# EAGLE design Shield STM32F407VET6 Mini (EAGLE 9.3.1)
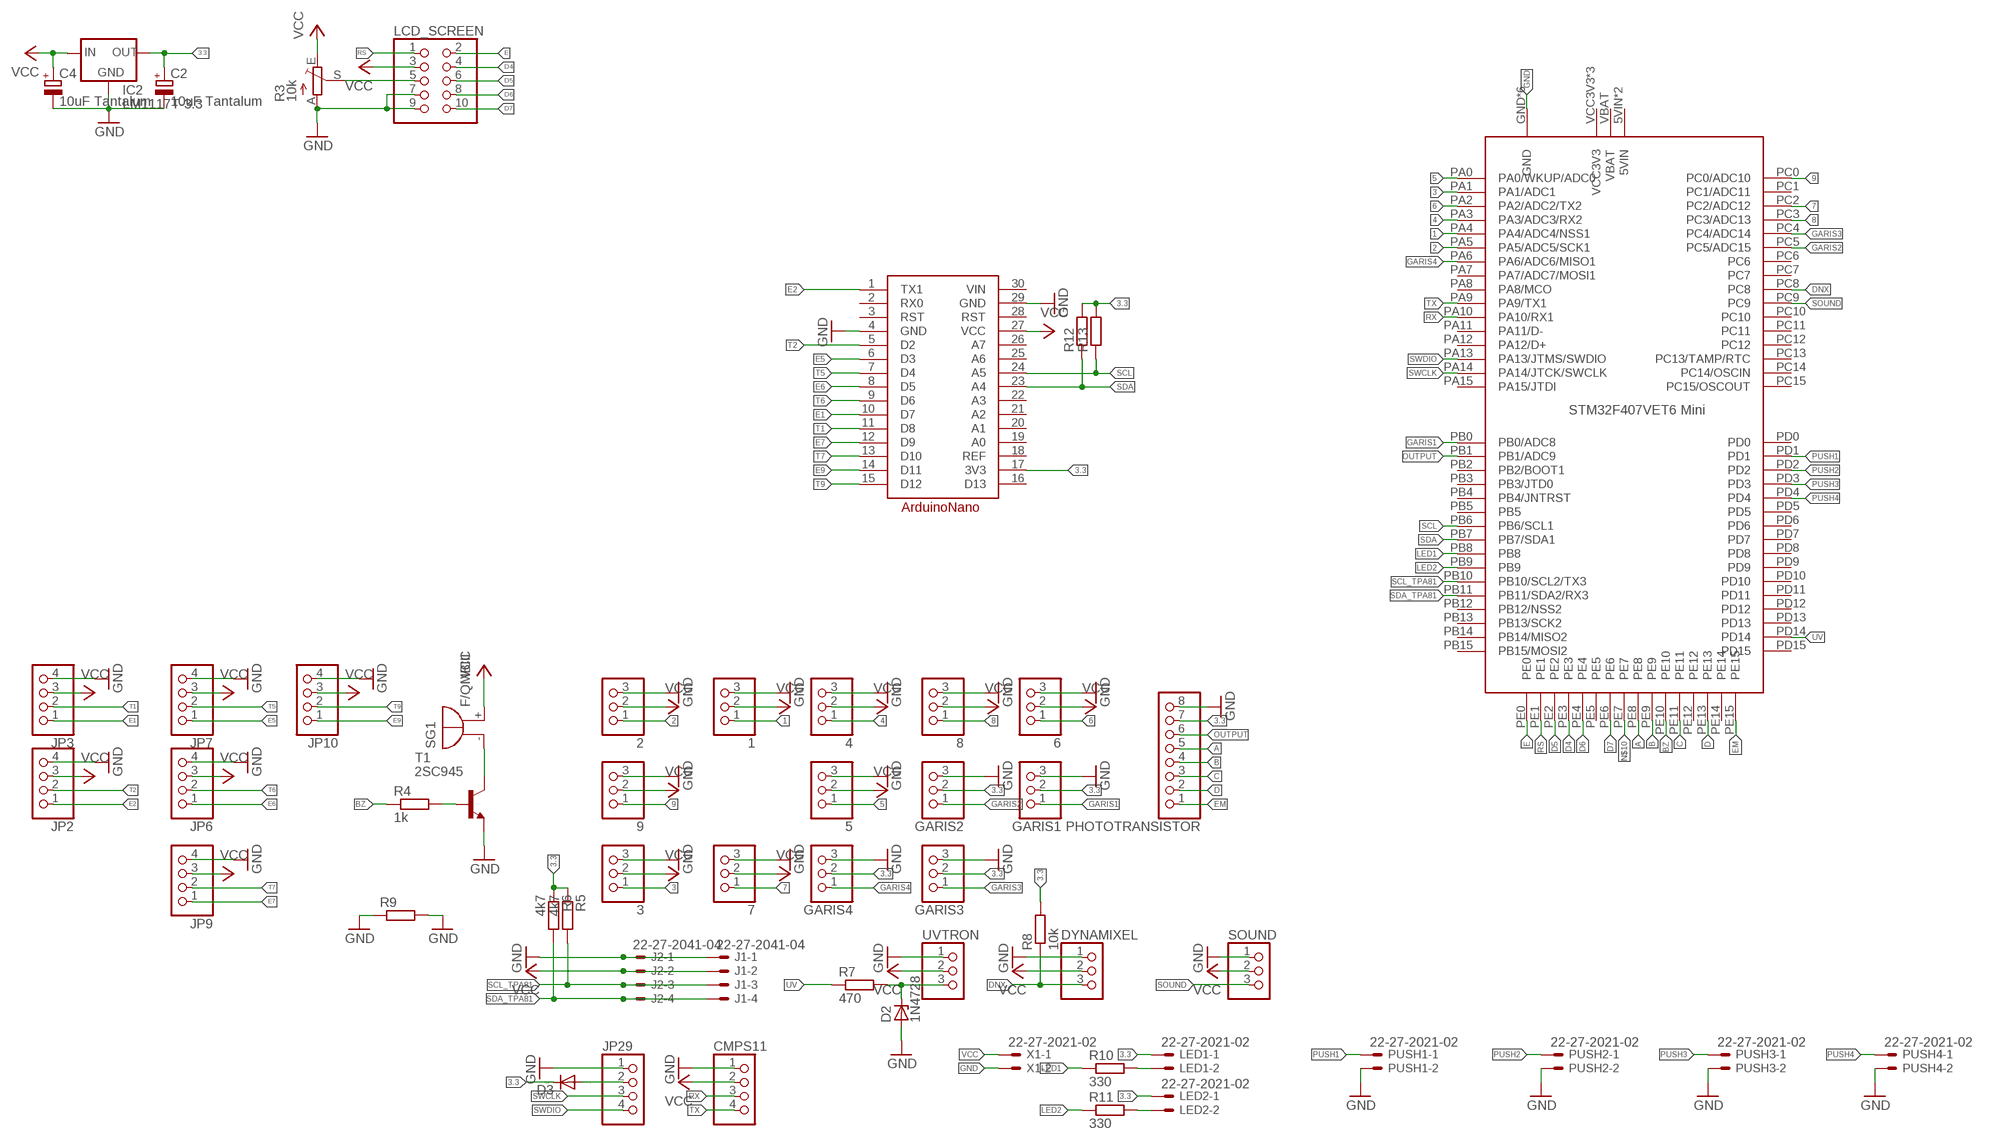
[diagram p0: schematic, sheet 1]

## Parts
1  PINHD-1X3  [1X03]
2  PINHD-1X3  [1X03]
3  PINHD-1X3  [1X03]
4  PINHD-1X3  [1X03]
5  PINHD-1X3  [1X03]
6  PINHD-1X3  [1X03]
7  PINHD-1X3  [1X03]
8  PINHD-1X3  [1X03]
9  PINHD-1X3  [1X03]
A1  ARDUINONANO  [ARDUINONANO]
C2  10uF Tantalum  CPOL-EUE2.5-5  [E2,5-5]
C4  10uF Tantalum  CPOL-EUE2.5-5  [E2,5-5]
CMPS11  PINHD-1X4  [1X04]
D2  1N4728  ZENER-DIODEZD-7.5  [ZDIO-7.5]
D3  DIODE-DO34-7  [DO34-7]
DYNAMIXEL  PINHD-1X3  [1X03]
GARIS1  PINHD-1X3  [1X03]
GARIS2  PINHD-1X3  [1X03]
GARIS3  PINHD-1X3  [1X03]
GARIS4  PINHD-1X3  [1X03]
IC2  LM1117T-3.3  [TO220]
J1  22-27-2041-04  [6410-04]
J2  22-27-2041-04  [6410-04]
JP2  PINHD-1X4  [1X04]
JP3  PINHD-1X4  [1X04]
JP6  PINHD-1X4  [1X04]
JP7  PINHD-1X4  [1X04]
JP9  PINHD-1X4  [1X04]
JP10  PINHD-1X4  [1X04]
JP29  PINHD-1X4  [1X04]
LCD_SCREEN  PINHD-2X5  [2X05]
LED1  22-27-2021-02  [6410-02]
LED2  22-27-2021-02  [6410-02]
PHOTOTRANSISTOR  PINHD-1X8  [1X08]
PUSH1  22-27-2021-02  [6410-02]
PUSH2  22-27-2021-02  [6410-02]
PUSH3  22-27-2021-02  [6410-02]
PUSH4  22-27-2021-02  [6410-02]
R3  10k  TRIM_EU-CA6V  [CA6V]
R4  1k  R-EU_0204/7  [0204/7]
R5  4k7  R-EU_0204/7  [0204/7]
R6  4k7  R-EU_0204/7  [0204/7]
R7  470  R-EU_0204/7  [0204/7]
R8  10k  R-EU_0204/7  [0204/7]
R9  R-EU_0204/5  [0204/5]
R10  330  R-EU_M1206  [M1206]
R11  330  R-EU_M1206  [M1206]
R12  R-EU_0204/7  [0204/7]
R13  R-EU_0204/7  [0204/7]
SG1  F/QMBIII  [F/QMBIII]
SOUND  PINHD-1X3  [1X03]
T1  2SC945  [TO92-ECB]
U$2  STM32F407VET6_MINI  [STM32F407VET6_MINI]
UVTRON  PINHD-1X3  [1X03]
X1  22-27-2021-02  [6410-02]

## Nets
1: 1.1 U$2.PA4(PA4/ADC4/NSS1)
2: 2.1 U$2.PA5(PA5/ADC5/SCK1)
3: 3.1 U$2.PA1(PA1/ADC1)
3.3: A1.17(3V3) C2.+ D3.C GARIS1.2 GARIS2.2 GARIS3.2 GARIS4.2 IC2.2(OUT) LED1.1 LED2.1 PHOTOTRANSISTOR.7 R5.1 R6.1 R8.2 R12.2 R13.2
4: 4.1 U$2.PA3(PA3/ADC3/RX2)
5: 5.1 U$2.PA0(PA0/WKUP/ADC0)
6: 6.1 U$2.PA2(PA2/ADC2/TX2)
7: 7.1 U$2.PC2(PC2/ADC12)
8: 8.1 U$2.PC3(PC3/ADC13)
9: 9.1 U$2.PC0(PC0/ADC10)
A: PHOTOTRANSISTOR.5 U$2.PE8
B: PHOTOTRANSISTOR.4 U$2.PE9
BZ: R4.1 U$2.PE10
C: PHOTOTRANSISTOR.3 U$2.PE11
D: PHOTOTRANSISTOR.2 U$2.PE13
D4: LCD_SCREEN.4 U$2.PE3
D5: LCD_SCREEN.6 U$2.PE2
D6: LCD_SCREEN.8 U$2.PE4
D7: LCD_SCREEN.10 U$2.PE6
DNX: DYNAMIXEL.3 R8.1 U$2.PC8
E: LCD_SCREEN.2 U$2.PE0
E1: A1.10(D7) JP3.1
E2: A1.1(TX1) JP2.1
E5: A1.6(D3) JP7.1
E6: A1.8(D5) JP6.1
E7: A1.12(D9) JP9.1
E9: A1.14(D11) JP10.1
EM: PHOTOTRANSISTOR.1 U$2.PE15
GARIS1: GARIS1.1 U$2.PB0(PB0/ADC8)
GARIS2: GARIS2.1 U$2.PC5(PC5/ADC15)
GARIS3: GARIS3.1 U$2.PC4(PC4/ADC14)
GARIS4: GARIS4.1 U$2.PA6(PA6/ADC6/MISO1)
GND: 1.3 2.3 3.3 4.3 5.3 6.3 7.3 8.3 9.3 A1.4(GND) A1.29(GND) C2.- C4.- CMPS11.1 D2.A DYNAMIXEL.1 GARIS1.3 GARIS2.3 GARIS3.3 GARIS4.3 IC2.1(GND) J1.1 J2.1 JP2.4 JP3.4 JP6.4 JP7.4 JP9.4 JP10.4 JP29.1 LCD_SCREEN.7 LCD_SCREEN.9 PHOTOTRANSISTOR.8 PUSH1.2 PUSH2.2 PUSH3.2 PUSH4.2 R3.A R9.1 R9.2 SOUND.1 T1.E U$2.GND U$2.GND@1(GND) U$2.GND@2(GND) U$2.GND@3(GND) U$2.GND@4(GND) U$2.GND@5(GND) UVTRON.1 X1.2
LED1: R10.1 U$2.PB8
LED2: R11.1 U$2.PB9
N$2: D3.A JP29.2
N$5: LED1.2 R10.2
N$6: D2.C R7.2 UVTRON.3
N$7: LCD_SCREEN.5 R3.S
N$8: LED2.2 R11.2
N$10: U$2.PE7
N$16: SG1.-(+) T1.C
N$17: R4.2 T1.B
OUTPUT: PHOTOTRANSISTOR.6 U$2.PB1(PB1/ADC9)
PUSH1: PUSH1.1 U$2.PD1
PUSH2: PUSH2.1 U$2.PD2
PUSH3: PUSH3.1 U$2.PD3
PUSH4: PUSH4.1 U$2.PD4
RS: LCD_SCREEN.1 U$2.PE1
RX: CMPS11.3 U$2.PA10(PA10/RX1)
SCL: A1.24(A5) R13.1 U$2.PB6(PB6/SCL1)
SCL_TPA81: J1.3 J2.3 R5.2 U$2.PB10(PB10/SCL2/TX3)
SDA: A1.23(A4) R12.1 U$2.PB7(PB7/SDA1)
SDA_TPA81: J1.4 J2.4 R6.2 U$2.PB11(PB11/SDA2/RX3)
SOUND: SOUND.3 U$2.PC9
SWCLK: JP29.3 U$2.PA14(PA14/JTCK/SWCLK)
SWDIO: JP29.4 U$2.PA13(PA13/JTMS/SWDIO)
T1: A1.11(D8) JP3.2
T2: A1.5(D2) JP2.2
T5: A1.7(D4) JP7.2
T6: A1.9(D6) JP6.2
T7: A1.13(D10) JP9.2
T9: A1.15(D12) JP10.2
TX: CMPS11.4 U$2.PA9(PA9/TX1)
UV: R7.1 U$2.PD14
VCC: 1.2 2.2 3.2 4.2 5.2 6.2 7.2 8.2 9.2 A1.27(VCC) C4.+ CMPS11.2 DYNAMIXEL.2 IC2.3(IN) J1.2 J2.2 JP2.3 JP3.3 JP6.3 JP7.3 JP9.3 JP10.3 LCD_SCREEN.3 R3.E SG1.+(-) SOUND.2 UVTRON.2 X1.1
Unconnected: A1.2(RX0) A1.3(RST) A1.16(D13) A1.19(A0) A1.20(A1) A1.21(A2) A1.22(A3) A1.25(A6) A1.26(A7) A1.28(RST) U$2.5VIN U$2.5VIN@1(5VIN) U$2.PA7(PA7/ADC7/MOSI1) U$2.PA8(PA8/MCO) U$2.PA11(PA11/D-) U$2.PA12(PA12/D+) U$2.PA15(PA15/JTDI) U$2.PB2(PB2/BOOT1) U$2.PB3(PB3/JTD0) U$2.PB4(PB4/JNTRST) U$2.PB5 U$2.PB12(PB12/NSS2) U$2.PB13(PB13/SCK2) U$2.PB14(PB14/MISO2) U$2.PB15(PB15/MOSI2) U$2.PC1(PC1/ADC11) U$2.PC6 U$2.PC7 U$2.PC10 U$2.PC11 U$2.PC12 U$2.PC13(PC13/TAMP/RTC) U$2.PC14(PC14/OSCIN) U$2.PC15(PC15/OSCOUT) U$2.PD0 U$2.PD5 U$2.PD6 U$2.PD7 U$2.PD8 U$2.PD9 U$2.PD10 U$2.PD11 U$2.PD12 U$2.PD13 U$2.PD15 U$2.PE5 U$2.PE12 U$2.PE14 U$2.VBAT U$2.VCC3V3 U$2.VCC3V3@1(VCC3V3) U$2.VCC3V3@2(VCC3V3)

## Power pins joined to a net without a drawn wire
REF: A1.18(REF)
VIN: A1.30(VIN)

## Library data of the parts
1-9 DYNAMIXEL GARIS1-GARIS4 SOUND UVTRON = pinhead:PINHD-1X3: PIN HEADER
A1 = ArduinoNano:ARDUINONANO
C2 C4 = rcl:CPOL-EU: POLARIZED CAPACITOR, European symbol
CMPS11 JP2 JP3 JP6 JP7 JP9 JP10 JP29 = pinhead:PINHD-1X4: PIN HEADER
D2 = diode:ZENER-DIODE: Z-Diode
D3 = diode:DIODE-: DIODE
IC2 = lm1117:LM1117T-*
J1 J2 = con-molex:22-?-04: CONNECTOR wire to board 2.54 mm (.1 inch) pitch header; OC_FARNELL: unknown; OC_NEWARK: unknown
LCD_SCREEN = pinhead:PINHD-2X5: PIN HEADER
LED1 LED2 PUSH1-PUSH4 X1 = con-molex:22-?-02: CONNECTOR wire to board 2.54 mm (.1 inch) pitch header; OC_FARNELL: unknown; OC_NEWARK: unknown
PHOTOTRANSISTOR = pinhead:PINHD-1X8: PIN HEADER
R3 = pot:TRIM_EU-: POTENTIOMETER
R4-R13 = rcl:R-EU_: RESISTOR, European symbol
SG1 = buzzer:F/QMBIII: BUZZER Source: Buerklin; OC_FARNELL: unknown; OC_NEWARK: unknown
T1 = transistor:2SC945: NPN Silicon Epitaxial Planar Transistor Source: SEMTECH ELECTRONICS LTD. ... 2SC945 2.pdf
U$2 = STM32F407VET6-Mini:STM32F407VET6_MINI: STM32F407VET6 Mini

## Board
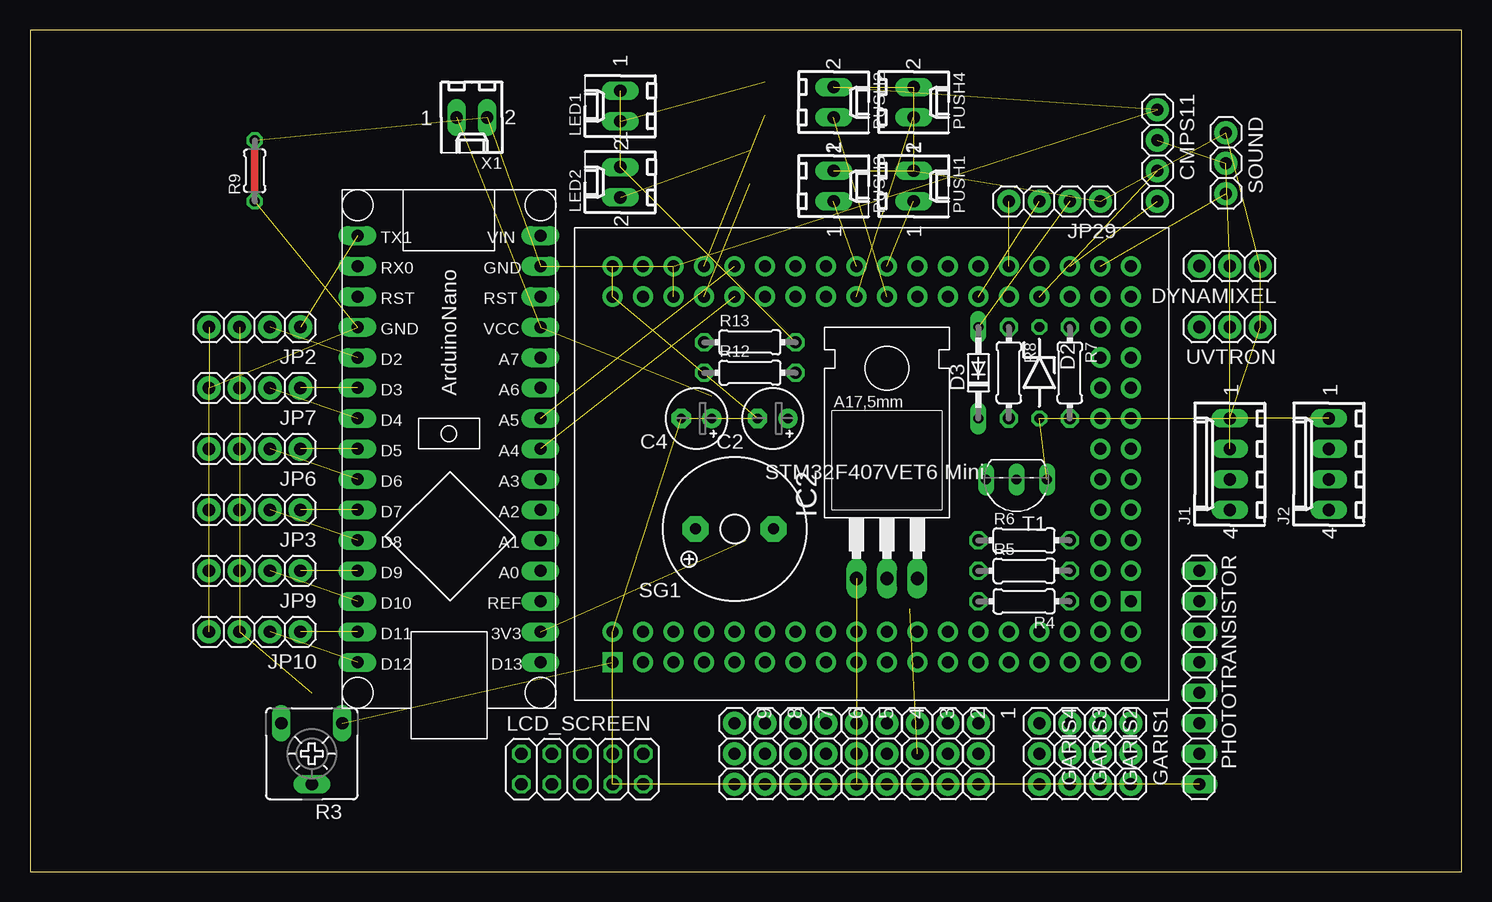
[diagram p1: board, top side]
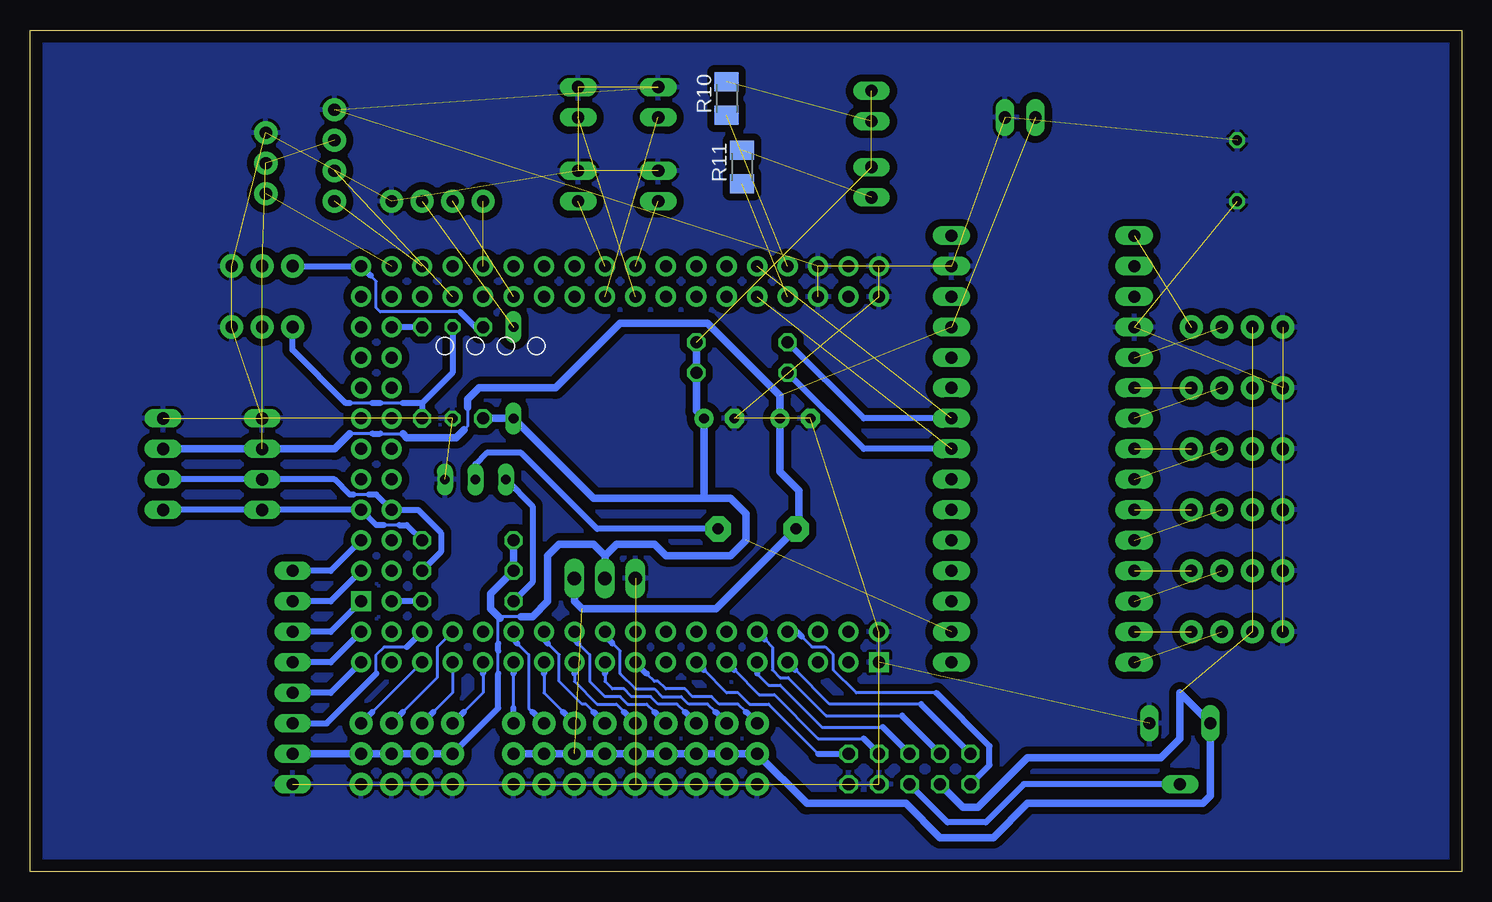
[diagram p2: board, bottom side, seen from below]

Size 119.36 x 70.16 mm. Coordinates in mm from the lower left corner, seen from the top.
Outline: 0,0 119.36,0 119.36,70.16 0,70.16 0,0
Copper layers (1*16): Top 0.035mm / dielectric 1.5mm / Bottom 0.035mm
Design rules "default *": minimum track width 6mil, minimum drill 0.35mm, track to track 6mil, track to pad 6mil, pad to pad 6mil, via to via 6mil, smd to smd 6mil, copper to edge 40mil, drill to drill 6mil, minimum pad ring 10mil, minimum via ring 8mil, stop-mask expansion 4mil, vias tented up to drill 0mil, thermal gap 10mil

### Footprints (pad centres in the part's own frame; a part is rotated, then mirrored left to right if it is on the bottom)
1X03 = drill 1.016 pad 1.93: 1 -2.54,0; 2 0,0; 3 2.54,0
ARDUINONANO = drill 1 pad 1.575 long: 1 -7.62,16.51; 2 -7.62,13.97; 3 -7.62,11.43; 4 -7.62,8.89; 5 -7.62,6.35; 6 -7.62,3.81; 7 -7.62,1.27; 8 -7.62,-1.27; 9 -7.62,-3.81; 10 -7.62,-6.35; 11 -7.62,-8.89; 12 -7.62,-11.43; 13 -7.62,-13.97; 14 -7.62,-16.51; 15 -7.62,-19.05; 16 7.62,-19.05; 17 7.62,-16.51; 18 7.62,-13.97; 19 7.62,-11.43; 20 7.62,-8.89; 21 7.62,-6.35; 22 7.62,-3.81; 23 7.62,-1.27; 24 7.62,1.27; 25 7.62,3.81; 26 7.62,6.35; 27 7.62,8.89; 28 7.62,11.43; 29 7.62,13.97; 30 7.62,16.51
E2,5-5 = drill 0.813 pad 1.6: + -1.27,0 | drill 0.813 pad 1.6 octagon: - 1.27,0
1X04 = drill 1.016 pad 1.93: 1 -3.81,0; 2 -1.27,0; 3 1.27,0; 4 3.81,0
ZDIO-7.5 = drill 0.813 octagon: A 3.81,0; C -3.81,0
DO34-7 = drill 0.813 long: A 3.81,0; C -3.81,0
TO220 = drill 1.118 long: 1 -2.54,-6.35; 2 0,-6.35; 3 2.54,-6.35
6410-04 = drill 1.016 long: 1 3.81,0; 2 1.27,0; 3 -1.27,0; 4 -3.81,0
2X05 = drill 1.016 octagon: 1 -5.08,-1.27; 2 -5.08,1.27; 3 -2.54,-1.27; 4 -2.54,1.27; 5 0,-1.27; 6 0,1.27; 7 2.54,-1.27; 8 2.54,1.27; 9 5.08,-1.27; 10 5.08,1.27
6410-02 = drill 1.016 long: 1 1.27,0; 2 -1.27,0
1X08 = drill 1.016 long: 1 -8.89,0; 2 -6.35,0; 3 -3.81,0; 4 -1.27,0; 5 1.27,0; 6 3.81,0; 7 6.35,0; 8 8.89,0
CA6V = drill 1.016 long: A -2.54,-2.54; E 2.54,-2.54; S 0,2.54
0204/7 = drill 1 octagon: 1 -3.81,0; 2 3.81,0
0204/5 = drill 0.813 octagon: 1 -2.54,0; 2 2.54,0
M1206 = smd 1.6 x 2: 1 -1.4,0; 2 1.4,0
F/QMBIII = drill 0.914 pad 2.159 octagon: + 3.251,0; - -3.251,0
TO92-ECB = drill 0.813 long: B 2.54,0; C 0,0; E -2.54,0
STM32F407VET6_MINI = drill 1 pad 1.676: 5VIN -16.51,-16.51; 5VIN@1 -16.51,-13.97; GND@1 -21.59,-13.97; GND@2 -16.51,16.51; GND@3 -16.51,13.97; GND@4 -21.59,16.51; GND@5 -21.59,13.97; PA0 3.81,-16.51; PA1 6.35,-16.51; PA2 3.81,-13.97; PA3 6.35,-13.97; PA4 8.89,-16.51; PA5 8.89,-13.97; PA6 11.43,-16.51; PA7 11.43,-13.97; PA8 16.51,13.97; PA9 16.51,16.51; PA10 13.97,13.97; PA11 13.97,16.51; PA12 11.43,13.97; PA13 11.43,16.51; PA14 8.89,13.97; PA15 8.89,16.51; PB0 16.51,-16.51; PB1 16.51,-13.97; PB2 19.05,-16.51; PB3 -6.35,13.97; PB4 -8.89,16.51; PB5 -8.89,13.97; PB6 -11.43,16.51; PB7 -11.43,13.97; PB8 -13.97,16.51; PB9 -13.97,13.97; PB10 19.05,-3.81; PB11 21.59,-3.81; PB12 19.05,-1.27; PB13 21.59,-1.27; PB14 19.05,1.27; PB15 21.59,1.27; PC0 -1.27,-16.51; PC1 -1.27,-13.97; PC2 1.27,-16.51; PC3 1.27,-13.97; PC4 13.97,-16.51; PC5 13.97,-13.97; PC6 21.59,13.97; PC7 19.05,13.97; PC8 21.59,16.51; PC9 19.05,16.51; PC10 6.35,13.97; PC11 6.35,16.51; PC12 3.81,16.51; PC13 -6.35,-13.97; PC14 -3.81,-16.51; PC15 -3.81,-13.97; PD0 3.81,13.97; PD1 1.27,16.51; PD2 1.27,13.97; PD3 -1.27,16.51; PD4 -1.27,13.97; PD5 -3.81,16.51; PD6 -3.81,13.97; PD7 -6.35,16.51; PD8 19.05,3.81; PD9 21.59,3.81; PD10 19.05,6.35; PD11 21.59,6.35; PD12 19.05,8.89; PD13 21.59,8.89; PD14 19.05,11.43; PD15 21.59,11.43; PE0 -13.97,-16.51; PE1 -13.97,-13.97; PE2 -11.43,-16.51; PE3 -11.43,-13.97; PE4 -8.89,-16.51; PE5 -8.89,-13.97; PE6 -6.35,-16.51; PE7 19.05,-13.97; PE8 21.59,-16.51; PE9 21.59,-13.97; PE10 19.05,-11.43; PE12 19.05,-8.89; PE13 21.59,-8.89; PE14 19.05,-6.35; PE15 21.59,-6.35; VBAT -19.05,-16.51; VCC3V3 -19.05,-13.97; VCC3V3@1 -19.05,16.51; VCC3V3@2 -19.05,13.97 | drill 1 pad 1.676 square: GND -21.59,-16.51; PE11 21.59,-11.43

### Placement (x,y rotation side)
1  79.06,9.84 270 top
2  76.52,9.84 270 top
3  73.98,9.84 270 top
4  71.44,9.84 270 top
5  68.9,9.84 270 top
6  66.36,9.84 270 top
7  63.82,9.84 270 top
8  61.28,9.84 270 top
9  58.74,9.84 270 top
A1  34.92,36.51 0 top
C2  61.91,37.78 180 top
C4  55.56,37.78 180 top
CMPS11  93.98,59.69 270 top
D2  84.14,41.59 270 top
D3  79.06,41.59 90 top
DYNAMIXEL  100.01,50.48 180 top
GARIS1  91.76,9.84 270 top
GARIS2  89.22,9.84 270 top
GARIS3  86.68,9.84 270 top
GARIS4  84.14,9.84 270 top
IC2  71.44,30.8 0 top
J1  100.01,33.97 90 top
J2  108.27,33.97 90 top
JP2  18.73,45.4 180 top
JP3  18.73,30.16 180 top
JP6  18.73,35.24 180 top
JP7  18.73,40.32 180 top
JP9  18.73,25.08 180 top
JP10  18.73,20 180 top
JP29  85.41,55.88 180 top
LCD_SCREEN  46.04,8.57 0 top
LED1  49.21,63.82 90 top
LED2  49.21,57.47 90 top
PHOTOTRANSISTOR  97.47,16.19 270 top
PUSH1  73.66,57.15 270 top
PUSH2  66.99,64.14 270 top
PUSH3  66.99,57.15 270 top
PUSH4  73.66,64.14 270 top
R3  23.5,9.84 180 top
R4  82.87,22.54 180 top
R5  82.87,25.08 0 top
R6  82.87,27.62 0 top
R7  86.68,41.59 270 top
R8  81.6,41.59 270 top
R9  18.73,58.42 90 top
R10  61.28,64.45 90 bottom
R11  60.01,58.74 90 bottom
R12  60.01,41.59 0 top
R13  60.01,44.13 0 top
SG1  58.74,28.57 180 top
SOUND  99.69,59.05 270 top
T1  82.23,32.7 180 top
U$2  70.17,33.97 0 top
UVTRON  100.01,45.4 180 top
X1  36.83,62.87 180 top

### Tracks (layer width: path | path; a pad name or v marks a point on that pad's centre or on a via)
1
  Bottom 0.254: 79.06,13.65 79.06,16.51
  Bottom 0.508: U$2.PA4 79.06,16.51 | 1.1 79.06,13.65
2
  Bottom 0.254: 77.47,13.34 77.79,13.65 77.79,18.1 78.74,19.05
  Bottom 0.508: U$2.PA5 79.06,19.37 78.74,19.05 | 2.1 77.47,13.34
3
  Bottom 0.254: 76.52,16.51 76.52,14.92 74.93,13.34
  Bottom 0.508: U$2.PA1 76.52,16.51 | 3.1 74.93,13.34
3.3  (3 unrouted)
  Bottom 0.254: 78.42,21.27 80.01,21.27 80.17,21.11 80.33,20.95 80.33,19.05 | 80.33,16.51 80.33,18.41
  Bottom 0.508: GARIS4.2 80.33,13.65 80.33,16.51 | 80.33,18.41 80.33,19.05
  Bottom 0.61: GARIS4.2 GARIS3.2 GARIS2.2 GARIS1.2 PHOTOTRANSISTOR.7 | R6.1 R5.1 80.96,23.18 80.96,21.91 80.17,21.11 | IC2.2 71.44,26.35 | 71.44,26.35 70.48,27.3 67.31,27.3 66.36,26.35 60.96,26.35 59.69,27.62 59.69,29.84 60.96,31.11 63.18,31.11 | 71.44,26.35 72.39,27.3 75.25,27.3 76.2,26.35 76.2,22.54 77.47,21.27 78.42,21.27 | R8.2 D3.C 72.39,31.11 63.18,31.11 | 63.18,31.11 C2.+ 63.82,38.42 R12.2 R13.2
4
  Bottom 0.254: 76.2,19.05 75.25,18.1 75.25,15.88 73.34,13.97 73.03,13.97 72.39,13.34
  Bottom 0.508: U$2.PA3 76.52,19.37 76.2,19.05 | 4.1 72.39,13.34
5
  Bottom 0.254: 73.98,16.51 73.98,15.88 72.07,13.97 70.48,13.97 69.85,13.34
  Bottom 0.508: U$2.PA0 73.98,16.51 | 5.1 69.85,13.34
6
  Bottom 0.254: 73.66,19.05 72.71,18.1 72.71,15.88 71.44,14.61 70.17,14.61 69.53,13.97 67.94,13.97 67.31,13.34
  Bottom 0.508: U$2.PA2 73.98,19.37 73.66,19.05 | 6.1 67.31,13.34
7
  Bottom 0.254: 71.44,16.51 71.44,15.88 70.8,15.24 69.85,15.24 69.22,14.61 67.63,14.61 66.99,13.97 65.41,13.97 64.77,13.34
  Bottom 0.508: U$2.PC2 71.44,16.51 | 7.1 64.77,13.34
8
  Bottom 0.254: 70.8,19.05 70.17,18.41 70.17,16.51 68.9,15.24 67.31,15.24 66.67,14.61 65.09,14.61 64.45,13.97 62.87,13.97 62.23,13.34
  Bottom 0.508: U$2.PC3 71.44,19.68 70.8,19.05 | 8.1 62.23,13.34
9
  Bottom 0.254: 59.69,13.34 60.33,13.97 61.91,13.97 62.55,14.61 64.14,14.61 64.77,15.24 66.36,15.24 66.99,15.88 67.31,15.88 67.94,16.51
  Bottom 0.508: U$2.PC0 67.94,16.51 | 9.1 59.69,13.34
A
  Bottom 0.508: U$2.PE8 94.3,14.92 PHOTOTRANSISTOR.5
B
  Bottom 0.508: U$2.PE9 94.3,17.46 PHOTOTRANSISTOR.4
BZ
  Bottom 0.508: R4.1 U$2.PE10
C
  Bottom 0.508: U$2.PE11 94.3,20 PHOTOTRANSISTOR.3
D
  Bottom 0.508: U$2.PE13 94.3,22.54 PHOTOTRANSISTOR.2
D4
  Bottom 0.254: 46.67,13.02 53,13.02 56.17,16.19 56.83,16.19 57.47,16.83 57.47,18.73 58.1,19.37
  Bottom 0.508: U$2.PE3 58.1,19.37 | 46.67,13.02 LCD_SCREEN.4
D5
  Bottom 0.254: 58.74,16.51 57.78,15.56 56.83,15.56 53.34,12.06 48.26,12.06
  Bottom 0.508: 48.26,12.06 LCD_SCREEN.6 | U$2.PE2 58.74,16.51
D6
  Bottom 0.254: 60.64,16.83 58.58,14.76 57.31,14.76 53.66,11.11 49.85,11.11
  Bottom 0.508: 49.85,11.11 LCD_SCREEN.8 | 60.64,16.83 U$2.PE4
D7
  Bottom 0.254: 63.18,16.83 61.28,14.92 60.33,14.92 59.37,13.97 57.78,13.97 53.66,9.84
  Bottom 0.508: U$2.PE6 63.18,16.83 | 53.66,9.84 LCD_SCREEN.10
DNX
  Bottom 0.254: 83.5,46.67 90.17,46.67 90.49,46.99 90.49,49.21 90.96,49.69
  Bottom 0.508: DYNAMIXEL.3 U$2.PC8 90.96,49.69 | R8.1 82.23,45.4 83.5,46.67
E
  Bottom 0.254: 45.09,13.97 52.7,13.97 55.56,16.83
  Bottom 0.508: LCD_SCREEN.2 45.09,13.97 | 55.56,16.83 U$2.PE0
E1  (1 unrouted)
E2  (1 unrouted)
E5  (1 unrouted)
E6  (1 unrouted)
E7  (1 unrouted)
E9  (1 unrouted)
EM
  Bottom 0.508: U$2.PE15 94.3,25.08 PHOTOTRANSISTOR.1
GARIS1
  Bottom 0.254: 90.81,13.34 U$2.PB0
  Bottom 0.508: GARIS1.1 90.81,13.34
GARIS2
  Bottom 0.254: U$2.PC5 85.41,18.73 85.41,16.19 88.27,13.34
  Bottom 0.508: GARIS2.1 88.27,13.34
GARIS3
  Bottom 0.254: U$2.PC4 84.14,14.92 85.72,13.34
  Bottom 0.508: 85.72,13.34 GARIS3.1
GARIS4
  Bottom 0.254: 81.6,16.51 81.6,14.92 83.19,13.34
  Bottom 0.508: U$2.PA6 81.6,16.51 | GARIS4.1 83.19,13.34
GND  (48 unrouted)
  Top 0.61: R9.2 R9.1
  pour Bottom (isolate 0.61): 0,70.17 119.38,70.17 119.38,0 0,0
LED1  (1 unrouted)
LED2  (1 unrouted)
N$2  (1 unrouted)
N$5  (1 unrouted)
N$6
  Bottom 0.254: 88.27,39.05 90.17,39.05 | 90.81,39.05 92.71,39.05
  Bottom 0.508: D2.C 84.14,41.59 86.68,39.05 | 90.17,39.05 90.81,39.05 | 92.71,39.05 93.03,39.05 97.47,43.5 UVTRON.3 | 86.68,39.05 88.27,39.05 | 86.68,39.05 R7.2
N$7
  Bottom 0.508: R3.S 36.51,7.3 39.69,4.13 42.86,4.13 LCD_SCREEN.5
N$8  (1 unrouted)
N$16
  Bottom 0.508: T1.C 82.23,33.97 81.28,34.92 78.42,34.92 72.07,28.57 SG1.-
N$17
  Bottom 0.508: T1.B 77.47,30.48 77.47,24.13 R4.2
OUTPUT
  Bottom 0.254: 87.95,18.73 89.85,18.73 90.49,18.1 90.49,16.51
  Bottom 0.508: U$2.PB1 87.95,18.73 | PHOTOTRANSISTOR.6 94.61,12.38 90.49,16.51
PUSH1  (1 unrouted)
PUSH2  (1 unrouted)
PUSH3  (1 unrouted)
PUSH4  (1 unrouted)
RS
  Bottom 0.254: 43.81,14.92 50.48,14.92 52.41,16.85 52.41,18.12 53.05,18.76 54.17,18.76 55.01,19.6
  Bottom 0.508: U$2.PE1 55.42,20 55.01,19.6 | LCD_SCREEN.1 39.37,8.89 39.37,10.48 43.81,14.92
RX  (1 unrouted)
SCL  (1 unrouted)
  Bottom 0.508: R13.1 49.85,37.78 A1.24
SCL_TPA81
  Bottom 0.254: 91.12,31.43 92.39,31.43
  Bottom 0.508: 92.39,31.43 92.71,31.43 93.98,32.7 J1.3 J2.3 | 91.12,31.43 90.49,31.43 U$2.PB10 87,30.16 85.09,28.26 85.09,26.67 R5.2
SDA  (1 unrouted)
  Bottom 0.508: R12.1 49.85,35.24 A1.23
SDA_TPA81
  Bottom 0.254: 88.58,28.89 89.85,28.89
  Bottom 0.508: 88.58,28.89 87.95,28.89 R6.2 | 89.85,28.89 90.49,28.89 U$2.PB11 J1.4 J2.4
SOUND  (1 unrouted)
SWCLK  (1 unrouted)
SWDIO  (1 unrouted)
T1  (1 unrouted)
T2  (1 unrouted)
T5  (1 unrouted)
T6  (1 unrouted)
T7  (1 unrouted)
T9  (1 unrouted)
TX  (1 unrouted)
UV
  Bottom 0.508: R7.1 U$2.PD14
VCC  (13 unrouted)
  Bottom 0.254: 90.17,36.51 88.27,36.51 | 90.81,36.51 92.71,36.51 | 82.87,38.73 82.87,37.15 83.19,36.83
  Bottom 0.508: 90.81,36.51 90.17,36.51
  Bottom 0.61: 1.2 2.2 3.2 4.2 5.2 6.2 7.2 8.2 9.2 54.61,5.71 46.35,5.71 43.5,2.86 39.05,2.86 36.2,5.71 21.59,5.71 20.95,6.35 R3.E 23.5,14.92 23.5,11.11 25.08,9.53 36.2,9.53 40.32,5.4 41.59,5.4 LCD_SCREEN.3 | IC2.3 73.98,22.54 73.34,21.91 62.15,21.91 SG1.+ 55.24,28.82 55.24,31.75 56.83,33.34 C4.+ 56.83,39.69 62.87,45.72 70.17,45.72 75.56,40.32 81.92,40.32 82.87,39.37 82.87,38.73 | 83.19,36.83 83.82,36.2 87.95,36.2 88.27,36.51 | 92.71,36.51 93.98,35.24 J1.2 J2.2